# Altium schematic sheet DAC.SchDoc
size A3
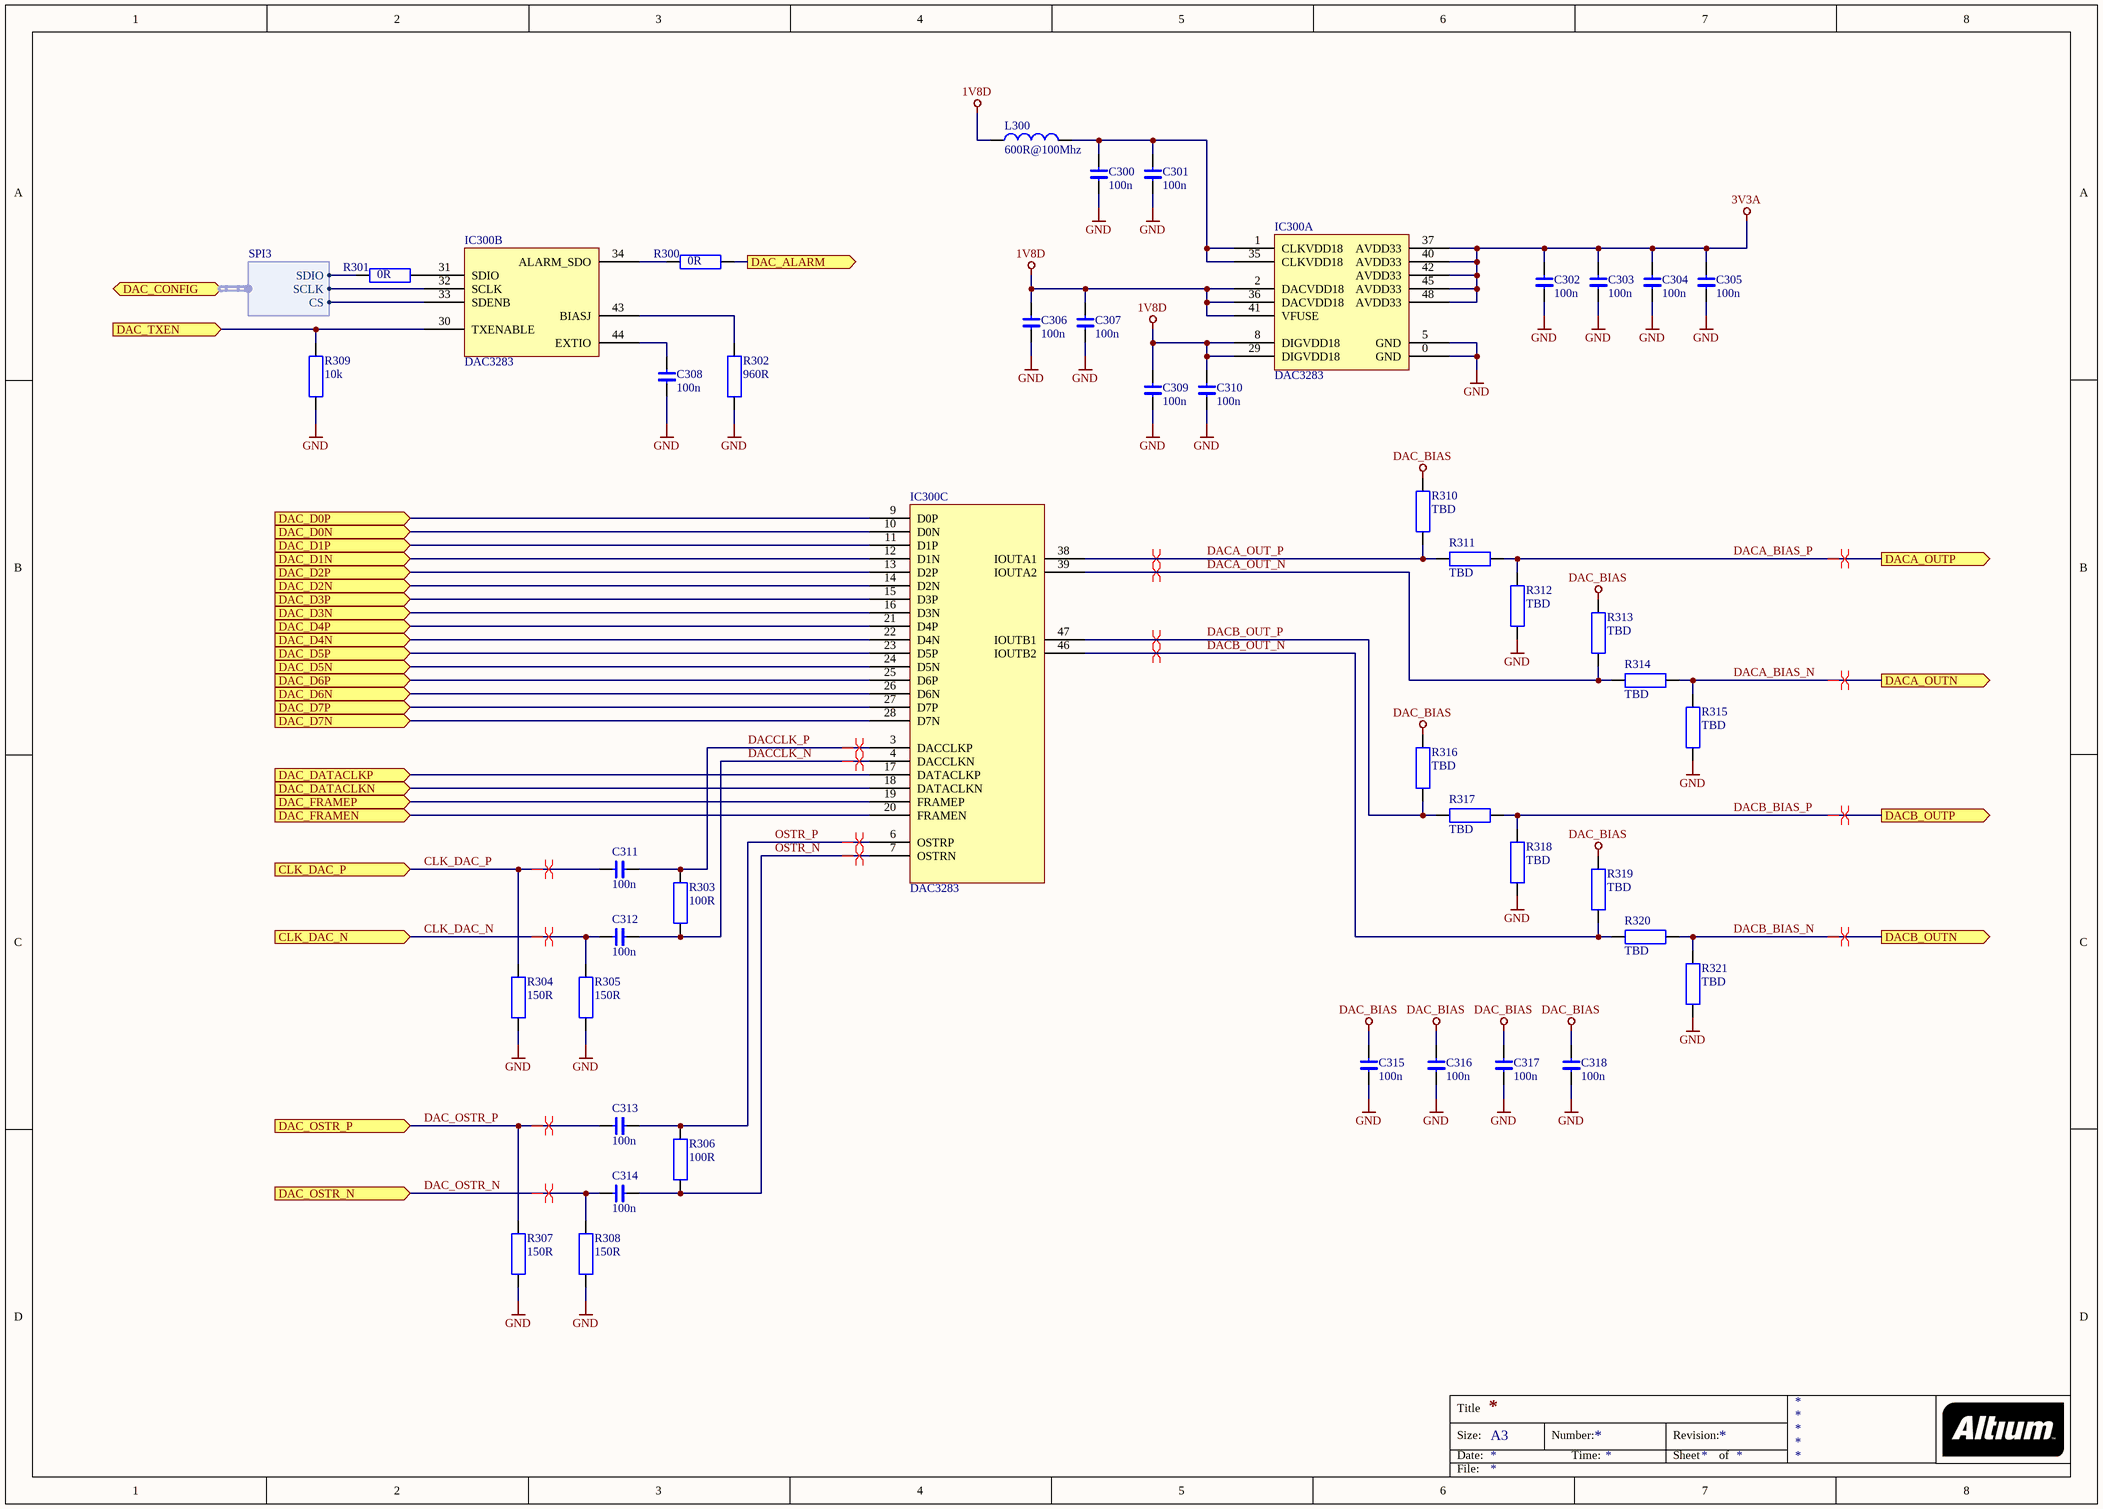
[diagram p0: DAC.SchDoc]

## Parts
C300  100n  [0603 SMALL OUTLINE]
C301  100n  [0603 SMALL OUTLINE]
C302  100n  [0603 SMALL OUTLINE]
C303  100n  [0603 SMALL OUTLINE]
C304  100n  [0603 SMALL OUTLINE]
C305  100n  [0603 SMALL OUTLINE]
C306  100n  [0603 SMALL OUTLINE]
C307  100n  [0603 SMALL OUTLINE]
C308  100n  [0603 SMALL OUTLINE]
C309  100n  [0603 SMALL OUTLINE]
C310  100n  [0603 SMALL OUTLINE]
C311  100n  [0603 SMALL OUTLINE]
C312  100n  [0603 SMALL OUTLINE]
C313  100n  [0603 SMALL OUTLINE]
C314  100n  [0603 SMALL OUTLINE]
C315  100n  [0603 SMALL OUTLINE]
C316  100n  [0603 SMALL OUTLINE]
C317  100n  [0603 SMALL OUTLINE]
C318  100n  [0603 SMALL OUTLINE]
IC300  DAC3283  [VQFN48_LONG]  (parts A,B,C of 3)
L300  600R@100Mhz  [0805]
R300  0R  [0603 SMALL OUTLINE]
R301  0R  [0603 SMALL OUTLINE]
R302  960R  [0603 SMALL OUTLINE]
R303  100R  [0603 SMALL OUTLINE]
R304  150R  [0603 SMALL OUTLINE]
R305  150R  [0603 SMALL OUTLINE]
R306  100R  [0603 SMALL OUTLINE]
R307  150R  [0603 SMALL OUTLINE]
R308  150R  [0603 SMALL OUTLINE]
R309  10k  [0603 SMALL OUTLINE]
R310  TBD  [0603 SMALL OUTLINE]
R311  TBD  [0603 SMALL OUTLINE]
R312  TBD  [0603 SMALL OUTLINE]
R313  TBD  [0603 SMALL OUTLINE]
R314  TBD  [0603 SMALL OUTLINE]
R315  TBD  [0603 SMALL OUTLINE]
R316  TBD  [0603 SMALL OUTLINE]
R317  TBD  [0603 SMALL OUTLINE]
R318  TBD  [0603 SMALL OUTLINE]
R319  TBD  [0603 SMALL OUTLINE]
R320  TBD  [0603 SMALL OUTLINE]
R321  TBD  [0603 SMALL OUTLINE]

## Ports
CLK_DAC_N (in), CLK_DAC_P (in), DAC_ALARM (out), DAC_CONFIG (harness SPI3), DAC_D0N (in), DAC_D0P (in), DAC_D1N (in), DAC_D1P (in), DAC_D2N (in), DAC_D2P (in), DAC_D3N (in), DAC_D3P (in), DAC_D4N (in), DAC_D4P (in), DAC_D5N (in), DAC_D5P (in), DAC_D6N (in), DAC_D6P (in), DAC_D7N (in), DAC_D7P (in), DAC_DATACLKN (in), DAC_DATACLKP (in), DAC_FRAMEN (in), DAC_FRAMEP (in), DAC_OSTR_N (in), DAC_OSTR_P (in), DAC_TXEN (in), DACA_OUTN (out), DACA_OUTP (out), DACB_OUTN (out), DACB_OUTP (out)

## Harnesses
SPI3: SDIO, SCLK, CS

## Nets
1V8D: C306.1 C307.1 C309.1 C310.1 IC300.2(DACVDD18) IC300.8(DIGVDD18) IC300.29(DIGVDD18) IC300.36(DACVDD18) IC300.41(VFUSE) L300.1
3V3A: C302.1 C303.1 C304.1 C305.1 IC300.37(AVDD33) IC300.40(AVDD33) IC300.42(AVDD33) IC300.45(AVDD33) IC300.48(AVDD33)
DAC_BIAS: C315.1 C316.1 C317.1 C318.1 R310.1 R313.1 R316.1 R319.1
GND: C300.2 C301.2 C302.2 C303.2 C304.2 C305.2 C306.2 C307.2 C308.1 C309.2 C310.2 C315.2 C316.2 C317.2 C318.2 IC300.0(GND) IC300.5(GND) R302.2 R304.2 R305.2 R307.2 R308.2 R309.2 R312.2 R315.2 R318.2 R321.2
CLK_DAC_N: C312.1 R305.1 ; port CLK_DAC_N
CLK_DAC_P: C311.1 R304.1 ; port CLK_DAC_P
DAC_ALARM: R300.2 ; port DAC_ALARM
DAC_D0N: IC300.10(D0N) ; port DAC_D0N
DAC_D0P: IC300.9(D0P) ; port DAC_D0P
DAC_D1N: IC300.12(D1N) ; port DAC_D1N
DAC_D1P: IC300.11(D1P) ; port DAC_D1P
DAC_D2N: IC300.14(D2N) ; port DAC_D2N
DAC_D2P: IC300.13(D2P) ; port DAC_D2P
DAC_D3N: IC300.16(D3N) ; port DAC_D3N
DAC_D3P: IC300.15(D3P) ; port DAC_D3P
DAC_D4N: IC300.22(D4N) ; port DAC_D4N
DAC_D4P: IC300.21(D4P) ; port DAC_D4P
DAC_D5N: IC300.24(D5N) ; port DAC_D5N
DAC_D5P: IC300.23(D5P) ; port DAC_D5P
DAC_D6N: IC300.26(D6N) ; port DAC_D6N
DAC_D6P: IC300.25(D6P) ; port DAC_D6P
DAC_D7N: IC300.28(D7N) ; port DAC_D7N
DAC_D7P: IC300.27(D7P) ; port DAC_D7P
DAC_DATACLKN: IC300.18(DATACLKN) ; port DAC_DATACLKN
DAC_DATACLKP: IC300.17(DATACLKP) ; port DAC_DATACLKP
DAC_FRAMEN: IC300.20(FRAMEN) ; port DAC_FRAMEN
DAC_FRAMEP: IC300.19(FRAMEP) ; port DAC_FRAMEP
DAC_OSTR_N: C314.1 R308.1 ; port DAC_OSTR_N
DAC_OSTR_P: C313.1 R307.1 ; port DAC_OSTR_P
DAC_TXEN: IC300.30(TXENABLE) R309.1 ; port DAC_TXEN
DACA_BIAS_N: R314.2 R315.1 ; port DACA_OUTN
DACA_BIAS_P: R311.2 R312.1 ; port DACA_OUTP
DACA_OUT_N: IC300.39(IOUTA2) R313.2 R314.1
DACA_OUT_P: IC300.38(IOUTA1) R310.2 R311.1
DACB_BIAS_N: R320.2 R321.1 ; port DACB_OUTN
DACB_BIAS_P: R317.2 R318.1 ; port DACB_OUTP
DACB_OUT_N: IC300.46(IOUTB2) R319.2 R320.1
DACB_OUT_P: IC300.47(IOUTB1) R316.2 R317.1
DACCLK_N: C312.2 IC300.4(DACCLKN) R303.2
DACCLK_P: C311.2 IC300.3(DACCLKP) R303.1
OSTR_N: C314.2 IC300.7(OSTRN) R306.2
OSTR_P: C313.2 IC300.6(OSTRP) R306.1
NetC300_1: C300.1 C301.1 IC300.1(CLKVDD18) IC300.35(CLKVDD18) L300.2
NetC308_2: C308.2 IC300.44(EXTIO)
NetIC300_31: IC300.31(SDIO) R301.2
NetIC300_32: IC300.32(SCLK) ; port DAC_CONFIG.SCLK
NetIC300_33: IC300.33(SDENB) ; port DAC_CONFIG.CS
NetIC300_34: IC300.34(ALARM_SDO) R300.1
NetIC300_43: IC300.43(BIASJ) R302.1
NetR301_1: R301.1 ; port DAC_CONFIG.SDIO

## Layout directives
differential pair: CLK_DAC_N, CLK_DAC_P, DAC_OSTR_N, DAC_OSTR_P, DACA_BIAS_N, DACA_BIAS_P, DACA_OUT_N, DACA_OUT_P, DACB_BIAS_N, DACB_BIAS_P, DACB_OUT_N, DACB_OUT_P, DACCLK_N, DACCLK_P, OSTR_N, OSTR_P

## Notes on the sheet
- Title
- Size:
- Date:
- A3
- Number:
- Time:
- Revision:
- Sheet
- of
- File:

## Library data of the parts
C300-C318 = C
IC300 = DAC3283: Dual-Channel,  16-Bit,  800  MSPS,  Digital-to-Analog  Converter  (DAC)
L300 = L
R300-R321 = R